# Altium schematic sheet host_connector.SchDoc: BioGAP WULPUS-pro shield
size A4; DrawnBy: IIS; Revision: 1.0.0; SheetNumber: 8; SheetTotal: 8
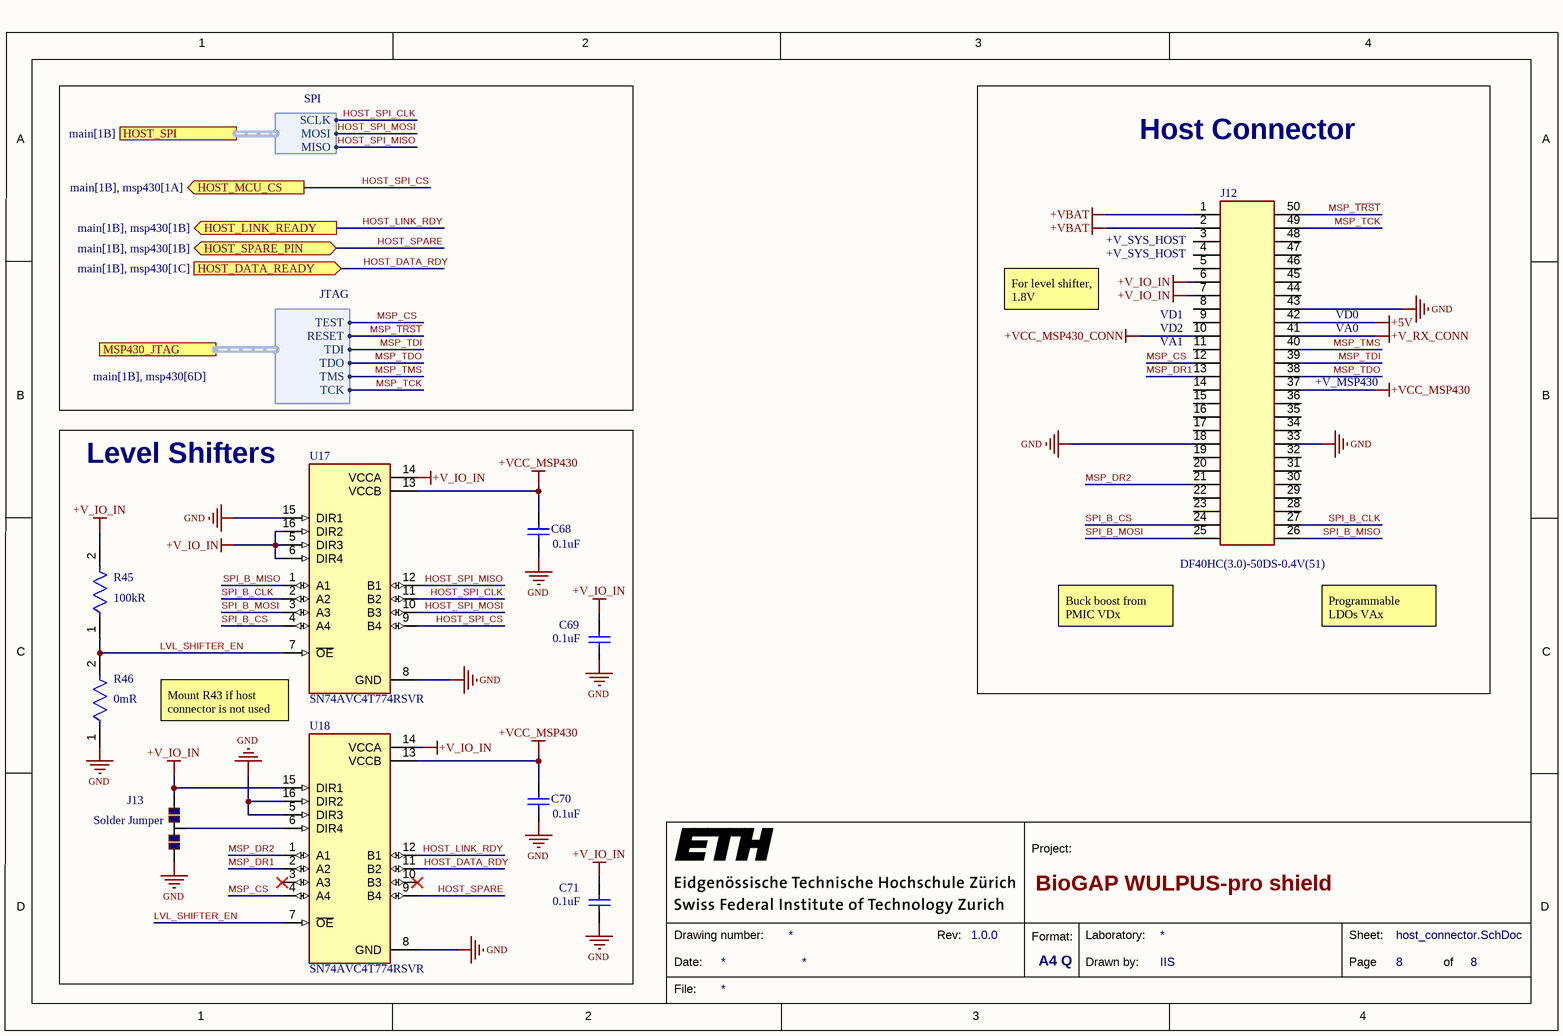
[diagram p0: host_connector.SchDoc]

## Parts
C68  Capacitance: 0.1uF  [CAPC1005X55X30LL05T10]  (hidden comment: C0402C104K4RACTU)
C69  Capacitance: 0.1uF  [CAPC1005X55X30LL05T10]  (hidden comment: C0402C104K4RACTU)
C70  Capacitance: 0.1uF  [CAPC1005X55X30LL05T10]  (hidden comment: C0402C104K4RACTU)
C71  Capacitance: 0.1uF  [CAPC1005X55X30LL05T10]  (hidden comment: C0402C104K4RACTU)
J12  DF40HC(3.0)-50DS-0.4V(51)  [DF40HC3050DS04V51]
J13  Solder Jumper  [Jumper 3 pins]  (no BOM)
R45  Resistance: 100kR  [FP-ERJ2RK-IPC_C]  (hidden comment: ERJ-2RKF1003X)
R46  Resistance: 0mR  [FP-CRCW0402-e3-IPC_C]  (hidden comment: CRCW04020000Z0ED)
U17  SN74AVC4T774RSVR  [QFN40P260X180X55-16N]
U18  SN74AVC4T774RSVR  [QFN40P260X180X55-16N]

## Blocks framed on the sheet
Host Connector: J12
Level Shifters: C68-C71 J13 R45 R46 U17 U18

## Ports
HOST_DATA_READY (in, see main[1B], msp430[1C]), HOST_LINK_READY (out, see main[1B], msp430[1B]), HOST_MCU_CS (out, see main[1B], msp430[1A]), HOST_SPARE_PIN (bidir, see main[1B], msp430[1B]), HOST_SPI (harness SPI, see main[1B]), MSP430_JTAG (harness JTAG, see main[1B], msp430[6D])

## Harnesses
SPI: SCLK, MOSI, MISO
JTAG: TEST, RESET, TDI, TDO, TMS, TCK

## Nets
+5V: J12.42
+V_IO_IN: C69.1 C71.1 J12.6 J12.7 J13.3 R45.2 U17.5(DIR3) U17.6(DIR4) U17.14(VCCA) U17.16(DIR2) U18.14(VCCA) U18.15(DIR1)
+V_RX_CONN: J12.41
+VBAT: J12.1 J12.2
+VCC_MSP430: C68.1 C70.1 J12.37 U17.13(VCCB) U18.13(VCCB)
+VCC_MSP430_CONN: J12.10
GND: C68.2 C69.2 C70.2 C71.2 J12.18 J12.33 J12.43 J13.1 R46.1 U17.8(GND) U17.15(DIR1) U18.5(DIR3) U18.8(GND) U18.16(DIR2)
HOST_DATA_RDY: U18.11(B2) ; port HOST_DATA_READY
HOST_LINK_RDY: U18.12(B1) ; port HOST_LINK_READY
HOST_SPARE: U18.9(B4) ; port HOST_SPARE_PIN
HOST_SPI_CLK: U17.11(B2) ; port HOST_SPI.SCLK
HOST_SPI_CS: U17.9(B4) ; port HOST_MCU_CS
HOST_SPI_MISO: U17.12(B1) ; port HOST_SPI.MISO
HOST_SPI_MOSI: U17.10(B3) ; port HOST_SPI.MOSI
LVL_SHIFTER_EN: R45.1 R46.2 U17.7(~{OE}) U18.7(~{OE})
MSP_CS: J12.12 U18.4(A4) ; port MSP430_JTAG.TEST
MSP_DR1: J12.13 U18.2(A2)
MSP_DR2: J12.21 U18.1(A1)
MSP_~{TRST}: J12.50 ; port MSP430_JTAG.RESET
MSP_TCK: J12.49 ; port MSP430_JTAG.TCK
MSP_TDI: J12.39 ; port MSP430_JTAG.TDI
MSP_TDO: J12.38 ; port MSP430_JTAG.TDO
MSP_TMS: J12.40 ; port MSP430_JTAG.TMS
SPI_B_CLK: J12.27 U17.2(A2)
SPI_B_CS: J12.24 U17.4(A4)
SPI_B_MISO: J12.26 U17.1(A1)
SPI_B_MOSI: J12.25 U17.3(A3)
NetJ13_2: J13.2 U18.6(DIR4)

Not connected (* = marked no-connect by the designer): J12 3 4 5 8 9 11 14 15 16 17 19 20 22 23 28 29 30 31 32 34 35 36 44 45 46 47 48; U18 3(A3)* 10(B3)*

## Notes on the sheet
- (near J12) +V_SYS_HOST
- For level shifter, 1.8V
- (near J12) VD1
- (near J12) VD2
- (near J12) VA1
- (near J12) +V_MSP430
- VD0
- VA0
- Buck boost from PMIC VDx
- Programmable LDOs VAx
- Mount R43 if host connector is not used
- 1
- 2
- 3
- 4
- A
- B
- C
- Project:
- D
- Date:
- Drawing number:
- Rev:
- Format:
- A4 Q
- Drawn by:
- Laboratory:
- Page
- Sheet:
- of
- File:

## Library data of the parts
C68-C71 = CMP-0001-00074-2: Manufacturer: Kemet; Part Number: C0402C104K4RACTU
J12 = DF40HC(3.0)-50DS-0.4V(51): 50 Position 0.4mm Pitch Dual Row Vertical Surface Mount (SMT) Pin Socket, 3.0mm Stacking Height; Mfr_Name: Hirose; Copyright: Copyright (C) 2023 Ultra Librarian. All rights reserved.; Manufacturer_Part_Number: DF40HC(3.0)-50DS-0.4V(51); RefDes: RefDes; Type: DEV
J13 = CMP-00467-6: Solder Jumper 3 Pads; Technology: SMT
R45 = CMP-2002-00608-4: Voltage Rating (DC): 50V; Tolerance: 1%; Power Rating: 100mW; Temperature Coefficient: 100ppm/°C; Case/Package: 0402; Length: 1mm; Package Quantity: 1; Radiation Hardening: No; Case Code (Metric): 1005; Contact Plating: Tin; Mount: Surface Mount; Depth: 0.5mm; Max Operating Temperature: 155°C; Lead Free: Lead Free; Width: 0.5mm; Composition: Thick Film; Case Code (Imperial): 0402; Termination: SMD/SMT; Number of Pins: 2; Height: 0.35mm; Voltage Rating: 50V; Military Standard: Not; REACH SVHC: No SVHC; Packaging: Tape and Reel; Min Operating Temperature: -55°C; Max Power Dissipation: 100mW; Features: Automotive AEC-Q200; Number of Terminations: 2
R46 = CMP-2002-08122-2: Tolerance: 5%; Max Power Dissipation: 63mW; Voltage Rating: 50V; Temperature Coefficient: 100ppm/°C; Contact Plating: Tin; Height: 0.35mm; Radiation Hardening: No; Features: Automotive AEC-Q200; Composition: Thick Film; Width: 0.5mm; Weight: 2.3E-05oz; Termination: SMD/SMT; Packaging: Tape and Reel; Mount: Surface Mount; Case Code (Metric): 1005; Military Standard: Not; Min Operating Temperature: -55°C; Number of Terminations: 2; Package Quantity: 1; Case Code (Imperial): 0402; Depth: 0.5mm; Max Operating Temperature: 155°C; Case/Package: 0402; Power Rating: 63mW; Lead Free: Lead Free; Voltage Rating (DC): 50V; Length: 1mm
U17 U18 = SN74AVC4T774RSVR: Voltage Level Translator Bidirectional 1 Circuit 4 Channel 380Mbps 16-UQFN _2.6x1.8_; MF: Texas Instruments; MP: SN74AVC4T774RSVR; DigiKey-Purchase-URL: https://snapeda.com/shop?store=DigiKey&id=192411; SnapEDA_Link: https://www.snapeda.com/parts/SN74AVC4T774RSVR/Texas%20Instruments/view-part/192411/?ref=snap; Digi-Key_Part_Number: 296-24741-1-ND; Package: UQFN-16 Texas Instruments; Value: *